# Altium project auto_turn.PrjPcb
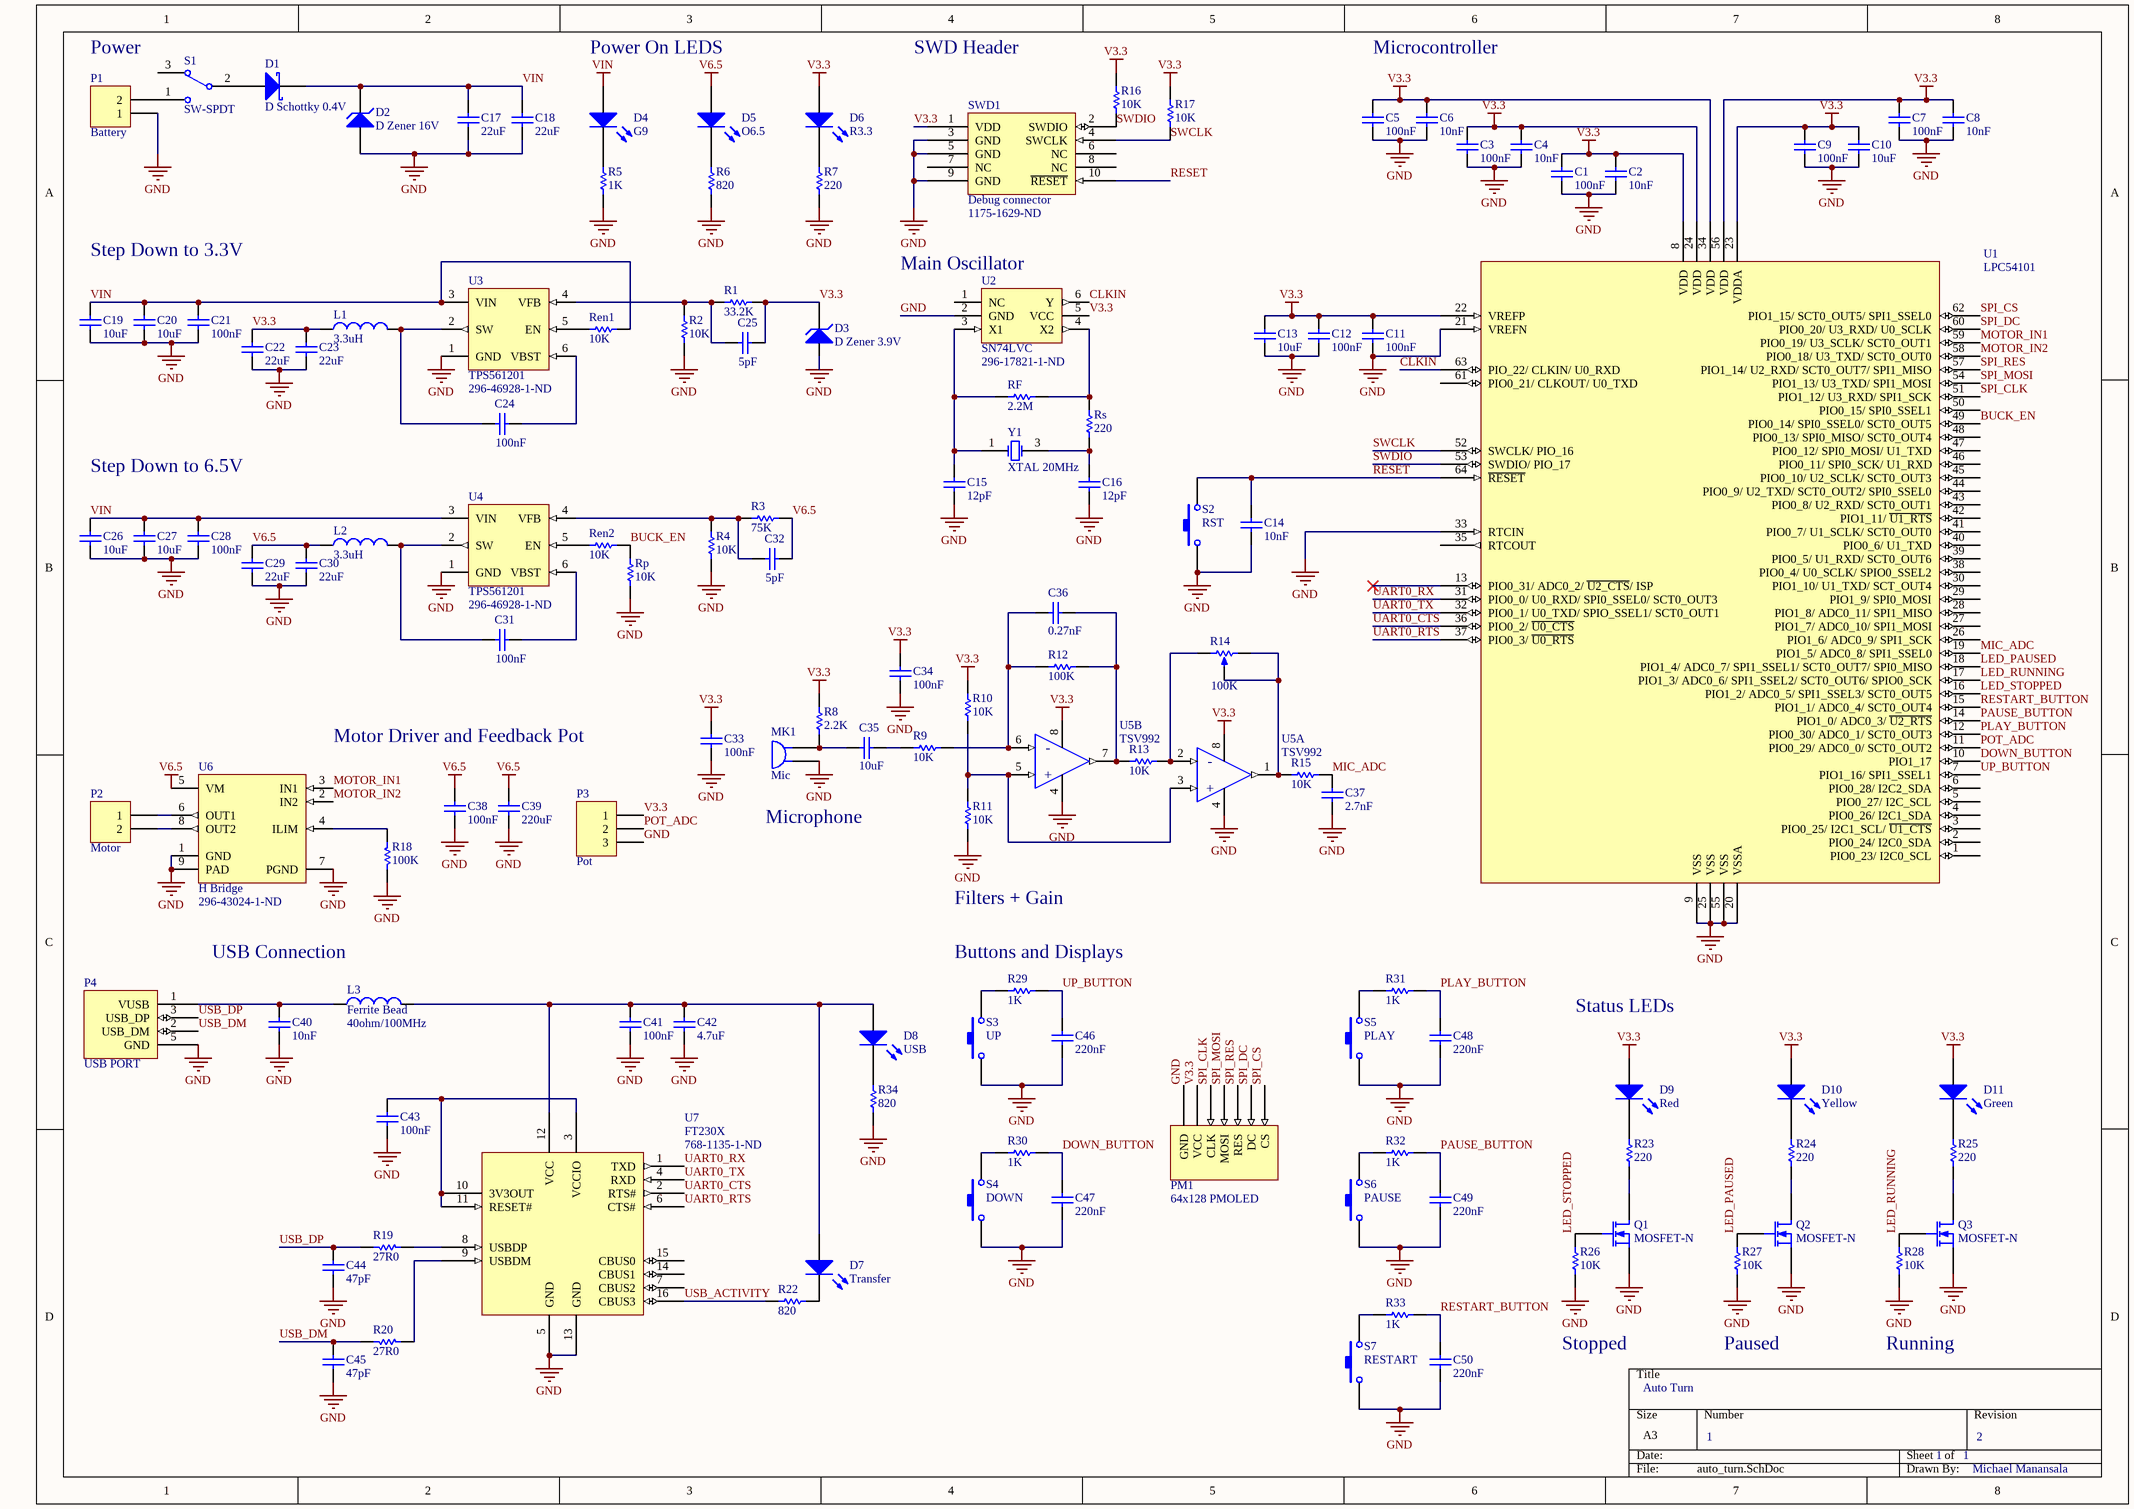
[diagram p0: auto_turn.SchDoc]
1 sheet, 127 parts. Net scope: global (net labels, ports and power ports of the same name join across sheets).
Board file: auto_turn.PcbDoc

## Sheet auto_turn.SchDoc
size A3

### Parts
C1  100nF  [0805 MD]
C2  10nF  [0805 MD]
C3  100nF  [0805 MD]
C4  10nF  [0805 MD]
C5  100nF  [0805 MD]
C6  10nF  [0805 MD]
C7  100nF  [0805 MD]
C8  10nF  [0805 MD]
C9  100nF  [0805 MD]
C10  10uF  [0805 MD]
C11  100nF  [0805 MD]
C12  100nF  [0805 MD]
C13  10uF  [0805 MD]
C14  10nF  [0805 MD]
C15  12pF  [0805 MD]
C16  12pF  [0805 MD]
C17  22uF  [0805 MD]
C18  22uF  [0805 MD]
C19  10uF  [0805 MD]
C20  10uF  [0805 MD]
C21  100nF  [0805 MD]
C22  22uF  [0805 MD]
C23  22uF  [0805 MD]
C24  100nF  [0805 MD]
C25  5pF  [0805 MD]
C26  10uF  [0805 MD]
C27  10uF  [0805 MD]
C28  100nF  [0805 MD]
C29  22uF  [0805 MD]
C30  22uF  [0805 MD]
C31  100nF  [0805 MD]
C32  5pF  [0805 MD]
C33  100nF  [0805 MD]
C34  100nF  [0805 MD]
C35  10uF  [0805 MD]
C36  value 0.27nF  [0805 MD]  (hidden comment: 270pF)
C37  2.7nF  [0805 MD]
C38  100nF  [0805 MD]
C39  220uF  [RAD-0.1]
C40  10nF  [0805 MD]
C41  100nF  [0805 MD]
C42  4.7uF  [0805 MD]
C43  100nF  [0805 MD]
C44  47pF  [0805 MD]
C45  47pF  [0805 MD]
C46  220nF  [0805 MD]
C47  220nF  [0805 MD]
C48  220nF  [0805 MD]
C49  220nF  [0805 MD]
C50  220nF  [0805 MD]
D1  D Schottky 0.4V  [DO219AB]
D2  D Zener 16V  [DO219AB]
D3  D Zener 3.9V  [DO219AB]
D4  G9  [0805 MD]
D5  O6.5  [0805 MD]
D6  R3.3  [0805 MD]
D7  Transfer  [0805 MD]
D8  USB  [0805 MD]
D9  Red  [5mm LED]
D10  Yellow  [5mm LED]
D11  Green  [5mm LED]
L1  3.3uH  [0805 MD]
L2  3.3uH  [0805 MD]
L3  Ferrite Bead  value 40ohm/100MHz  [0805 MD]
MK1  Mic  [CMA-4544PF-W]
P1  Battery  [HDR1X2]
P2  Motor  [HDR1X2]
P3  Pot  [HDR1X3]
P4  USB PORT  [USB Micro B]
PM1  64x128 PMOLED  [PMOLED 128x64]
Q1  MOSFET-N  [SOT23]
Q2  MOSFET-N  [SOT23]
Q3  MOSFET-N  [SOT23]
R1  33.2K  [0805 MD]
R2  10K  [0805 MD]
R3  75K  [0805 MD]
R4  10K  [0805 MD]
R5  1K  [0805 MD]
R6  820  [0805 MD]
R7  220  [0805 MD]
R8  2.2K  [0805 MD]
R9  10K  [0805 MD]
R10  10K  [0805 MD]
R11  10K  [0805 MD]
R12  100K  [0805 MD]
R13  10K  [0805 MD]
R14  100K  [Trimmer 23B]
R15  10K  [0805 MD]
R16  10K  [0805 MD]
R17  10K  [0805 MD]
R18  100K  [0805 MD]
R19  27R0  [0805 MD]
R20  27R0  [0805 MD]
R22  820  [0805 MD]
R23  220  [0805 MD]
R24  220  [0805 MD]
R25  220  [0805 MD]
R26  10K  [0805 MD]
R27  10K  [0805 MD]
R28  10K  [0805 MD]
R29  1K  [0805 MD]
R30  1K  [0805 MD]
R31  1K  [0805 MD]
R32  1K  [0805 MD]
R33  1K  [0805 MD]
R34  820  [0805 MD]
Ren1  10K  [0805 MD]
Ren2  10K  [0805 MD]
RF  2.2M  [0805 MD]
Rp  10K  [0805 MD]
Rs  220  [0805 MD]
S1  SW-SPDT  [MFS101D-8-Z]
S2  RST  [Pushbutton KMR2]
S3  UP  [Pushbutton KMR2]
S4  DOWN  [Pushbutton KMR2]
S5  PLAY  [Pushbutton KMR2]
S6  PAUSE  [Pushbutton KMR2]
S7  RESTART  [Pushbutton KMR2]
SWD1  Debug connector  Supplier Part Number 1: 1175-1629-ND  [ARM SWD connector]
U1  LPC54101  [LQFP64]
U2  SN74LVC  Supplier Part Number 1: 296-17821-1-ND  [SOT236]
U3  TPS561201  Supplier Part Number 1: 296-46928-1-ND  [SOT236]
U4  TPS561201  Supplier Part Number 1: 296-46928-1-ND  [SOT236]
U5  TSV992  [SOIC-8]  (parts A,B of 2)
U6  H Bridge  Supplier Part Number 1: 296-43024-1-ND  [SOIC-8 PP]
U7  FT230X  Supplier Part Number 1: 768-1135-1-ND  [SSOP-16 FTDI]
Y1  XTAL 20MHz  [SMD XTAL 4Pin]

### Nets
GND: C1.1 C2.1 C3.1 C4.1 C5.1 C6.1 C7.1 C8.1 C9.1 C10.1 C11.1 C12.1 C13.1 C14.1 C15.1 C16.1 C17.1 C18.1 C19.1 C20.1 C21.1 C22.1 C23.1 C26.1 C27.1 C28.1 C29.1 C30.1 C33.1 C34.1 C37.1 C38.1 C39.1 C40.1 C41.1 C42.1 C43.1 C44.1 C45.1 C46.1 C47.1 C48.1 C49.1 C50.1 D2.1(A) D3.1(A) MK1.1 P1.1 P3.3 P4.5(GND) PM1.1(GND) Q1.3(S) Q2.3(S) Q3.3(S) R2.1 R4.1 R5.2 R6.1 R7.1 R11.1 R18.1 R26.1 R27.1 R28.1 R34.1 Rp.1 S2.1 S3.1 S4.1 S5.1 S6.1 S7.1 SWD1.3(GND) SWD1.5(GND) SWD1.9(GND) U1.9(VSS) U1.20(VSSA) U1.21(VREFN) U1.25(VSS) U1.33(RTCIN) U1.55(VSS) U2.2(GND) U3.1(GND) U4.1(GND) U5.4(VCC+) U6.1(GND) U6.7(PGND) U6.9(PAD) U7.5(GND) U7.13(GND) Y1.2(GND) Y1.4(GND)
V3.3: C1.2 C2.2 C3.2 C4.2 C5.2 C6.2 C7.2 C8.2 C9.2 C10.2 C11.2 C12.2 C13.2 C22.2 C23.2 C25.1 C33.2 C34.2 D3.2(K) D6.1(A) D9.1(A) D10.1(A) D11.1(A) L1.1 P3.1 PM1.2(VCC) R1.2 R8.2 R10.2 R16.2 R17.2 SWD1.1(VDD) U1.8(VDD) U1.22(VREFP) U1.23(VDDA) U1.24(VDD) U1.34(VDD) U1.56(VDD) U2.5(VCC) U5.8(VCC-)
V6.5: C29.2 C30.2 C32.1 C38.2 C39.2 D5.1(A) L2.1 R3.2 U6.5(VM)
VIN: C17.2 C18.2 C19.2 C20.2 C21.2 C26.2 C27.2 C28.2 D1.2(K) D2.2(K) D4.1(A) Ren1.2 U3.3(VIN) U4.3(VIN)
BUCK_EN: Ren2.2 Rp.2 U1.49(PIO0_14/_SPI0_SSEL0/_SCT0_OUT5)
CLKIN: U1.63(PIO_22/_CLKIN/_U0_RXD) U2.6(Y)
DOWN_BUTTON: C47.2 R30.1 U1.10(PIO1_17)
LED_PAUSED: Q2.2(G) R27.2 U1.18(PIO1_4/_ADC0_7/_SPI1_SSEL1/_SCT0_OUT7/_SPI0_MISO)
LED_RUNNING: Q3.2(G) R28.2 U1.17(PIO1_3/_ADC0_6/_SPI1_SSEL2/_SCT0_OUT6/_SPIO0_SCK)
LED_STOPPED: Q1.2(G) R26.2 U1.16(PIO1_2/_ADC0_5/_SPI1_SSEL3/_SCT0_OUT5)
MIC_ADC: C37.2 R15.2 U1.19(PIO1_5/_ADC0_8/_SPI1_SSEL0)
MOTOR_IN1: U1.59(PIO0_19/_U3_SCLK/_SCT0_OUT1) U6.3(IN1)
MOTOR_IN2: U1.58(PIO0_18/_U3_TXD/_SCT0_OUT0) U6.2(IN2)
PAUSE_BUTTON: C49.2 R32.1 U1.14(PIO1_0/_ADC0_3/_~{U2_RTS})
PLAY_BUTTON: C48.2 R31.1 U1.12(PIO0_30/_ADC0_1/_SCT0_OUT3)
POT_ADC: P3.2 U1.11(PIO0_29/_ADC0_0/_SCT0_OUT2)
RESET: C14.2 S2.2 SWD1.10(~{RESET}) U1.64(~{RESET})
RESTART_BUTTON: C50.2 R33.1 U1.15(PIO1_1/_ADC0_4/_SCT0_OUT4)
SPI_CLK: PM1.3(CLK) U1.51(PIO1_12/_U3_RXD/_SPI1_SCK)
SPI_CS: PM1.7(CS) U1.62(PIO1_15/_SCT0_OUT5/_SPI1_SSEL0)
SPI_DC: PM1.6(DC) U1.60(PIO0_20/_U3_RXD/_U0_SCLK)
SPI_MOSI: PM1.4(MOSI) U1.54(PIO1_13/_U3_TXD/_SPI1_MOSI)
SPI_RES: PM1.5(RES) U1.57(PIO1_14/_U2_RXD/_SCT0_OUT7/_SPI1_MISO)
SWCLK: R17.1 SWD1.4(SWCLK) U1.52(SWCLK/_PIO_16)
SWDIO: R16.1 SWD1.2(SWDIO) U1.53(SWDIO/_PIO_17)
UART0_CTS: U1.36(PIO0_2/_~{U0_CTS}) U7.2(RTS#)
UART0_RTS: U1.37(PIO0_3/_~{U0_RTS}) U7.6(CTS#)
UART0_RX: U1.31(PIO0_0/_U0_RXD/_SPI0_SSEL0/_SCT0_OUT3) U7.1(TXD)
UART0_TX: U1.32(PIO0_1/_U0_TXD/_SPIO_SSEL1/_SCT0_OUT1) U7.4(RXD)
UP_BUTTON: C46.2 R29.1 U1.7(PIO1_16/_SPI1_SSEL1)
USB_ACTIVITY: R22.2 U7.16(CBUS3)
USB_DM: C45.2 P4.2(USB_DM) R20.2
USB_DP: C44.2 P4.3(USB_DP) R19.2
NetC15_2: C15.2 RF.1 U2.3(X1) Y1.1(OSC1)
NetC16_2: C16.2 Rs.1 Y1.3(OSC2)
NetC24_1: C24.1 U3.6(VBST)
NetC24_2: C24.2 L1.2 U3.2(SW)
NetC25_2: C25.2 R1.1 R2.2 U3.4(VFB)
NetC31_1: C31.1 U4.6(VBST)
NetC31_2: C31.2 L2.2 U4.2(SW)
NetC32_2: C32.2 R3.1 R4.2 U4.4(VFB)
NetC35_1: C35.1 R9.1
NetC35_2: C35.2 MK1.2 R8.1
NetC36_1: C36.1 R12.2 R13.1 U5.7(OUT2)
NetC36_2: C36.2 R9.2 R12.1 U5.6(IN2-)
NetC40_2: C40.2 L3.1 P4.1(VUSB)
NetC41_2: C41.2 C42.2 D7.1(A) D8.1(A) L3.2 U7.12(VCC)
NetC43_2: C43.2 U7.3(VCCIO) U7.10(3V3OUT) U7.11(RESET#)
NetD1_1: D1.1(A) S1.2
NetD4_2: D4.2(K) R5.1
NetD5_2: D5.2(K) R6.2
NetD6_2: D6.2(K) R7.2
NetD7_2: D7.2(K) R22.1
NetD8_2: D8.2(K) R34.2
NetD9_2: D9.2(K) R23.2
NetD10_2: D10.2(K) R24.2
NetD11_2: D11.2(K) R25.2
NetP1_2: P1.2 S1.1
NetP2_1: P2.1 U6.6(OUT1)
NetP2_2: P2.2 U6.8(OUT2)
NetQ1_1: Q1.1(D) R23.1
NetQ2_1: Q2.1(D) R24.1
NetQ3_1: Q3.1(D) R25.1
NetR10_1: R10.1 R11.2 U5.3(IN1+) U5.5(IN2+)
NetR13_2: R13.2 R14.1(TOP) U5.2(IN1-)
NetR14_2: R14.2(BOT) R14.3(TAP) R15.1 U5.1(OUT1)
NetR18_2: R18.2 U6.4(ILIM)
NetR19_1: R19.1 U7.8(USBDP)
NetR20_1: R20.1 U7.9(USBDM)
NetR29_2: R29.2 S3.2
NetR30_2: R30.2 S4.2
NetR31_2: R31.2 S5.2
NetR32_2: R32.2 S6.2
NetR33_2: R33.2 S7.2
NetRen1_1: Ren1.1 U3.5(EN)
NetRen2_1: Ren2.1 U4.5(EN)
NetRF_2: RF.2 Rs.2 U2.4(X2)

Not connected (* = marked no-connect by the designer): S1 3; SWD1 6(NC) 7(NC) 8(NC); U1 1(PIO0_23/_I2C0_SCL) 2(PIO0_24/_I2C0_SDA) 3(PIO0_25/_I2C1_SCL/_~{U1_CTS}) 4(PIO0_26/_I2C1_SDA) 5(PIO0_27/_I2C_SCL) 6(PIO0_28/_I2C2_SDA) 13(PIO0_31/_ADC0_2/_~{U2_CTS}/_ISP)* 26(PIO1_6/_ADC0_9/_SPI1_SCK) 27(PIO1_7/_ADC0_10/_SPI1_MOSI) 28(PIO1_8/_ADC0_11/_SPI1_MISO) 29(PIO1_9/_SPI0_MOSI) 30(PIO1_10/_U1_TXD/_SCT_OUT4) 35(RTCOUT) 38(PIO0_4/_U0_SCLK/_SPIO0_SSEL2) 39(PIO0_5/_U1_RXD/_SCT0_OUT6) 40(PIO0_6/_U1_TXD) 41(PIO0_7/_U1_SCLK/_SCT0_OUT0) 42(PIO1_11/_~{U1_RTS}) 43(PIO0_8/_U2_RXD/_SCT0_OUT1) 44(PIO0_9/_U2_TXD/_SCT0_OUT2/_SPI0_SSEL0) 45(PIO0_10/_U2_SCLK/_SCT0_OUT3) 46(PIO0_11/_SPI0_SCK/_U1_RXD) 47(PIO0_12/_SPI0_MOSI/_U1_TXD) 48(PIO0_13/_SPI0_MISO/_SCT0_OUT4) 50(PIO0_15/_SPI0_SSEL1) 61(PIO0_21/_CLKOUT/_U0_TXD); U2 1(NC); U7 7(CBUS2) 14(CBUS1) 15(CBUS0)

### Notes on the sheet
- Power
- Power On LEDS
- SWD Header
- Microcontroller
- Step Down to 3.3V
- (near U2) Main Oscillator
- Step Down to 6.5V
- (near U6) Motor Driver and Feedback Pot
- Microphone
- Filters + Gain
- (near P4) USB Connection
- (near R29) Buttons and Displays
- Status LEDs
- Stopped
- Auto Turn
- Paused
- Running
- 1
- 2
- Michael Manansala
- (in symbol TSV992, part A) -; +
- (in symbol TSV992, part B) -; +

### Library data of the parts
C1 C3 C5 C7 C9 C11 C12 C21 C24 C28 C31 C33 C34 C38 C41 C43 = Cap: Capacitor; Manufacturer: Samsung Electro-Mechanics America, Inc.; ManufacturerPartNumber: CL21B104JBCNNNC; Voltage - Rated: 50V; Value: 100nF; Supplier 1: Digi-Key; Supplier Part Number 1: 1276-1090-1-ND
C2 C4 C6 C8 C14 C40 = Cap: Capacitor; Manufacturer: Samsung Electro-Mechanics America, Inc.; ManufacturerPartNumber: CL21B103JBANNNC; Voltage - Rated: 50V; Value: 10nF; Supplier 1: Digi-Key; Supplier Part Number 1: 1276-1245-1-ND
C10 C13 C19 C20 C26 C27 C35 = Cap: Capacitor; Manufacturer: Samsung Electro-Mechanics America, Inc.; ManufacturerPartNumber: CL21A106KOCLRNC; Voltage - Rated: 16V; Value: 10uF; Supplier 1: Digi-Key; Supplier Part Number 1: 1276-2399-1-ND
C15 C16 = Cap: Capacitor; Manufacturer: Samsung Electro-Mechanics America, Inc.; ManufacturerPartNumber: CL21C120JBANNNC; Voltage - Rated: 50V; Value: 12pF; Supplier 1: Digi-Key; Supplier Part Number 1: 1276-1120-1-ND
C17 C18 C22 C23 C29 C30 = Cap: Capacitor; Manufacturer: Samsung Electro-Mechanics America, Inc.; ManufacturerPartNumber: CL21A226MOCLRNC; Voltage - Rated: 16V; Value: 22uF; Supplier 1: Digi-Key; Supplier Part Number 1: 1276-6780-1-ND
C25 C32 = Cap: Capacitor; Manufacturer: Samsung Electro-Mechanics America, Inc.; ManufacturerPartNumber: CL21C050CBANNNC; Voltage - Rated: 50V; Value: 5pF; Supplier 1: Digi-Key; Supplier Part Number 1: 1276-2552-1-ND
C36 = Cap: Capacitor; Manufacturer: Samsung Electro-Mechanics America, Inc.; ManufacturerPartNumber: CL21B271KCANNNC; Voltage - Rated: 100V; Supplier 1: Digi-Key; Supplier Part Number 1: 1276-2494-1-ND
C37 = Cap: Capacitor; Manufacturer: Samsung Electro-Mechanics America, Inc.; ManufacturerPartNumber: CL21C272JBFNNNE; Voltage - Rated: 50V; Value: 2.7nF; Supplier 1: Digi-Key; Supplier Part Number 1: 1276-6527-1-ND
C39 = Cap: Capacitor; Manufacturer: Nichicon; ManufacturerPartNumber: UVR1C221MED; Voltage - Rated: 16V; Value: 220uF; Supplier 1: Digi-Key; Supplier Part Number 1: 493-1041-ND
C42 = Cap: Capacitor; Manufacturer: Samsung Electro-Mechanics America, Inc.; ManufacturerPartNumber: CL21A475KQFNNNG; Voltage - Rated: 6.3V; Value: 4.7uF; Supplier 1: Digi-Key; Supplier Part Number 1: 1276-6465-1-ND
C44 C45 = Cap: Capacitor; Manufacturer: Samsung Electro-Mechanics America, Inc.; ManufacturerPartNumber: CL21C470JBANNNC; Voltage - Rated: 50V; Value: 47pF; Supplier 1: Digi-Key; Supplier Part Number 1: 1276-1156-1-ND
C46-C50 = Cap: Capacitor; Manufacturer: Samsung Electro-Mechanics America, Inc.; ManufacturerPartNumber: CL21B224KAFNNNG; Voltage - Rated: 15V; Value: 220nF; Supplier 1: Digi-Key; Supplier Part Number 1: 1276-6477-1-ND
D1 = D Schottky: Schottky Diode; Manufacturer: Vishay Semiconductor Diodes Division; ManufacturerPartNumber: SL02-GS08; Supplier 1: Digi-Key; Supplier Part Number 1: SL02-GS08CT-ND
D2 = D Zener: Zener Diode; Manufacturer: Vishay Semiconductor Diodes Division; ManufacturerPartNumber: BZD27C16P-E3-08; Supplier 1: Digi-Key; Supplier Part Number 1: BZD27C16P-E3-08GICT-ND
D3 = D Zener: Zener Diode; Manufacturer: Vishay Semiconductor Diodes Division; ManufacturerPartNumber: BZD27B3V9P-M3-08; Supplier 1: Digi-Key; Supplier Part Number 1: BZD27B3V9P-M3-08GICT-ND
D4 D8 = LED1: LED Green; Manufacturer: Lite-On Inc.; ManufacturerPartNumber: LTST-C171KGKT; Supplier 1: Digi-Key; Supplier Part Number 1: 160-1426-1-ND
D5 = LED1: LED Orange; Manufacturer: Lite-On Inc.; ManufacturerPartNumber: LTST-C170KFKT; Supplier 1: Digi-Key; Supplier Part Number 1: 160-1413-1-ND
D6 = LED1: LED Red; Manufacturer: Lite-On Inc.; ManufacturerPartNumber: LTST-C171KRKT; Supplier 1: Digi-Key; Supplier Part Number 1: 160-1427-1-ND
D7 = LED1: Green LED; Manufacturer: Lite-On Inc.; ManufacturerPartNumber: LTST-C171KRKT; Supplier 1: Digi-Key; Supplier Part Number 1: 160-1427-1-ND
D9 = LED1: LED Red; Manufacturer: Kingbright; ManufacturerPartNumber: WP7113ID; Supplier 1: Digi-Key; Supplier Part Number 1: 754-1264-ND
D10 = LED1: LED Yellow; Manufacturer: Kingbright; ManufacturerPartNumber: WP7113ND; Supplier 1: Digi-Key; Supplier Part Number 1: 754-1896-ND
D11 = LED1: LED Green; Manufacturer: Kingbright; ManufacturerPartNumber: WP7113GD; Supplier 1: Digi-Key; Supplier Part Number 1: 754-1263-ND
L1 L2 = Inductor: Manufacturer: Taiyo Yuden; ManufacturerPartNumber: BRC2012T3R3MD; Value: 3.3uH; Supplier 1: Digi-Key; Supplier Part Number 1: 587-2906-1-ND
L3 = Inductor: Manufacturer: Laird-Signal Integrity Products; ManufacturerPartNumber: MI0805K400R-10; Supplier 1: Digi-Key; Supplier Part Number 1: 240-2389-1-ND
MK1 = Mic1: Electret Microphone; Manufacturer: CUI Inc.; ManufacturerPartNumber: CMA-4544PF-W; Supplier 1: Digi-Key; Supplier Part Number 1: 102-1721-ND
P1 = Header 2: Header, 2-Pin
P2 = Header 2: Header, 2-Pin; Manufacturer: DFRobot; ManufacturerPartNumber: FIT0495-E; Speed: 73 RPM; Supplier 1: Digi-Key; Supplier Part Number 1: 1738-1283-ND
P3 = Header 3: Header, 3-Pin; Manufacturer: Bourns Inc.; ManufacturerPartNumber: PDB241-E420P-103B0; Value: 10K; Supplier 1: Digi-Key; Supplier Part Number 1: PDB241-E420P-103B0-ND
P4 = USB PORT: Manufacturer: Amphenol FCI; ManufacturerPartNumber: 10118192-0001LF; Supplier 1: Digi-Key; Supplier Part Number 1: 609-4613-1-ND
PM1 = PMOLED: Passive Matrix Organic LED Display
Q1-Q3 = MOSFET-N: DMN2005K-7DICT-ND; Manufacturer: Diodes Incorporated; ManufacturerPartNumber: DMN2005K-7; Supplier 1: Digi-Key; Supplier Part Number 1: DMN2005K-7DICT-ND
R1 = Res1: Resistor; Manufacturer: Stackpole Electronics; ManufacturerPartNumber: RMCF0805FT33K2; Value: 33.2K; Supplier 1: Digi-Key; Supplier Part Number 1: RMCF0805FT33K2CT-ND
R2 R4 R9-R11 R13 R15-R17 R26-R28 Ren1 Ren2 Rp = Res1: Resistor; Manufacturer: Stackpole Electronics; ManufacturerPartNumber: RMCF0805FT10K0; Value: 10K; Supplier 1: Digi-Key; Supplier Part Number 1: RMCF0805FT10K0CT-ND
R3 = Res1: Resistor; Manufacturer: Stackpole Electronics; ManufacturerPartNumber: RMCF0805FT75K0; Value: 75K; Supplier 1: Digi-Key; Supplier Part Number 1: RMCF0805FT75K0CT-ND
R5 R29-R33 = Res1: Resistor; Manufacturer: Stackpole Electronics; ManufacturerPartNumber: RMCF0805FT1K00; Value: 1K; Supplier 1: Digi-Key; Supplier Part Number 1: RMCF0805FT1K00CT-ND
R6 R22 R34 = Res1: Resistor; Manufacturer: Stackpole Electronics; ManufacturerPartNumber: RMCF0805FT820R; Value: 820; Supplier 1: Digi-Key; Supplier Part Number 1: RMCF0805FT820RCT-ND
R7 R23-R25 Rs = Res1: Resistor; Manufacturer: Stackpole Electronics; ManufacturerPartNumber: RMCF0805FT220R; Value: 220; Supplier 1: Digi-Key; Supplier Part Number 1: RMCF0805FT220RCT-ND
R8 = Res1: Resistor; Manufacturer: Stackpole Electronics; ManufacturerPartNumber: RMCF0805FT2K20; Value: 2.2K; Supplier 1: Digi-Key; Supplier Part Number 1: RMCF0805FT2K20CT-ND
R12 R18 = Res1: Resistor; Manufacturer: Stackpole Electronics; ManufacturerPartNumber: RMCF0805FT100K; Value: 100K; Supplier 1: Digi-Key; Supplier Part Number 1: RMCF0805FT100KCT-ND
R14 = RPot: Potentiometer; Manufacturer: TT Electronics/BI; ManufacturerPartNumber: 23BR100KLFTR; Value: 100K; Supplier 1: Digi-Key; Supplier Part Number 1: 987-1013-1-ND
R19 R20 = Res1: Resistor; Manufacturer: Stackpole Electronics; ManufacturerPartNumber: RMCF0805FT27R0; Value: 27R0; Supplier 1: Digi-Key; Supplier Part Number 1: RMCF0805FT27R0CT-ND
RF = Res1: Resistor; Manufacturer: Stackpole Electronics; ManufacturerPartNumber: RMCF0805JT2M20; Value: 2.2M; Supplier 1: Digi-Key; Supplier Part Number 1: RMCF0805JT2M20CT-ND
S1 = SW-SPDT: Manufacturer: Copal Electronics Inc.; ManufacturerPartNumber: MFS101D-8-Z; Supplier 1: Digi-Key; Supplier Part Number 1: 563-1556-ND
S2-S7 = SW-PB: Switch; Manufacturer: C&K; ManufacturerPartNumber: KMR231NG LFS; Supplier 1: Digi-Key; Supplier Part Number 1: CKN10246CT-ND
SWD1 = Debug connector: ARM 10 pin SWD connecttor; Manufacturer: CNC Tech; ManufacturerPartNumber: 3220-10-0300-00; Supplier 1: Digi-Key
U1 = LPC54101: LPC54101 uC 64 pin; ManufacturerPartNumber: LPC54101J256BD64QL; Manufacturer: NXP; Supplier 1: DigiKey; Supplier Part Number 1: 568-12886-ND
U2 = SN74LVC1GX04: Crystal Oscillator Driver IC SOT-23-6; ManufacturerPartNumber: SN74LVC1GX04DBVR; Manufacturer: Texas Instruments; Supplier 1: Digi-Key
U3 U4 = TPS561201: Buck Regulator; Manufacturer: Texas Instruments; ManufacturerPartNumber: TPS561201DDCT; Supplier 1: Digi-Key
U5 = TSV992: Dual Op Amp; ManufacturerPartNumber: TSV992IYDT; Manufacturer: ST Electronics; Supplier 1: DigiKey; Supplier Part Number 1: 497-10359-1-ND
U6 = DRV8871: Half Bridge DC Motor Driver; Manufacturer: Texas Instruments; ManufacturerPartNumber: DRV8871DDAR; Supplier 1: Digi-Key
U7 = FT230X: FT230X USB TO BASIC UART IC; Manufacturer: FTDI; ManufacturerPartNumber: FT230X; Supplier 1: Digi-Key
Y1 = XTAL: Crystal Oscillator; Manufacturer: Abracon LLC; ManufacturerPartNumber: ABM3B-20.000MHZ-10-1-U-T; Supplier 1: Digi-Key; Supplier Part Number 1: 300-8214-1-ND